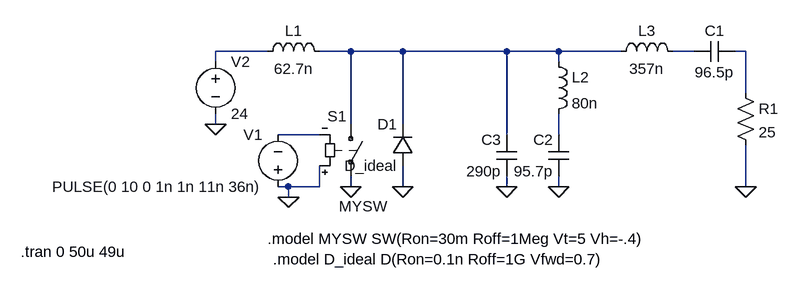
[diagram p0: schematic class_phi2_paper.asc]
class_phi2_paper.asc, the LTspice schematic file:
Version 4
SHEET 1 984 680
WIRE 192 64 112 64
WIRE 320 64 272 64
WIRE 400 64 320 64
WIRE 560 64 400 64
WIRE 640 64 560 64
WIRE 736 64 640 64
WIRE 848 64 816 64
WIRE 928 64 912 64
WIRE 112 80 112 64
WIRE 640 80 640 64
WIRE 928 128 928 64
WIRE 112 176 112 160
WIRE 320 176 320 64
WIRE 400 176 400 64
WIRE 272 192 208 192
WIRE 560 192 560 64
WIRE 640 192 640 160
WIRE 224 272 208 272
WIRE 272 272 272 240
WIRE 272 272 224 272
WIRE 320 272 320 256
WIRE 400 272 400 240
WIRE 560 272 560 256
WIRE 640 272 640 256
WIRE 928 272 928 208
WIRE 224 288 224 272
FLAG 320 272 0
FLAG 560 272 0
FLAG 640 272 0
FLAG 112 176 0
FLAG 928 272 0
FLAG 224 288 0
FLAG 400 272 0
SYMBOL voltage 208 288 R180
WINDOW 0 24 96 Left 2
WINDOW 3 24 16 Left 2
WINDOW 123 0 0 Left 2
WINDOW 39 0 0 Left 2
SYMATTR InstName V1
SYMATTR Value PULSE(0 10 0 1n 1n 11n 36n)
SYMBOL voltage 112 64 R0
WINDOW 123 0 0 Left 2
WINDOW 39 0 0 Left 2
SYMATTR InstName V2
SYMATTR Value 24
SYMBOL sw 320 160 R0
WINDOW 0 -36 4 Left 2
WINDOW 3 -18 142 Left 2
SYMATTR InstName S1
SYMATTR Value MYSW
SYMBOL ind 176 80 R270
WINDOW 0 32 56 VTop 2
WINDOW 3 5 56 VBottom 2
SYMATTR InstName L1
SYMATTR Value 62.7n
SYMBOL ind 624 64 R0
SYMATTR InstName L2
SYMATTR Value 80n
SYMBOL ind 720 80 R270
WINDOW 0 32 56 VTop 2
WINDOW 3 5 56 VBottom 2
SYMATTR InstName L3
SYMATTR Value 357n
SYMBOL cap 912 48 R90
WINDOW 0 0 32 VBottom 2
WINDOW 3 32 32 VTop 2
SYMATTR InstName C1
SYMATTR Value 96.5p
SYMBOL cap 656 256 R180
WINDOW 0 24 56 Left 2
WINDOW 3 24 8 Left 2
SYMATTR InstName C2
SYMATTR Value 95.7p
SYMBOL cap 576 256 R180
WINDOW 0 24 56 Left 2
WINDOW 3 24 8 Left 2
SYMATTR InstName C3
SYMATTR Value 290p
SYMBOL res 912 112 R0
SYMATTR InstName R1
SYMATTR Value 25
SYMBOL diode 416 240 R180
WINDOW 0 24 64 Left 2
WINDOW 3 24 0 Left 2
SYMATTR InstName D1
SYMATTR Value D_ideal
TEXT 192 352 Left 2 !.model MYSW SW(Ron=30m Roff=1Meg Vt=5 Vh=-.4)
TEXT -188 372 Left 2 !.tran 0 50u 49u
TEXT 200 384 Left 2 !.model D_ideal D(Ron=0.1n Roff=1G Vfwd=0.7)

The netlist it stands for:
* class_phi2_paper.asc
V1 0 N005 PULSE(0 10 0 1n 1n 11n 36n)
V2 N001 0 24
S1 N002 0 0 N005 MYSW
L1 N001 N002 62.7n
L2 N002 N006 80n
L3 N002 N003 357n
C1 N004 N003 96.5p
C2 0 N006 95.7p
C3 0 N002 290p
R1 N004 0 25
D1 0 N002 D_ideal
.model D D
.lib standard.dio
.model MYSW SW(Ron=30m Roff=1Meg Vt=5 Vh=-.4)
.tran 0 50u 49u
.model D_ideal D(Ron=0.1n Roff=1G Vfwd=0.7)
.backanno
.end